# Altium schematic sheet 13-DPLL-02.SchDoc
size B; SheetNumber: 13; SheetTotal: 16
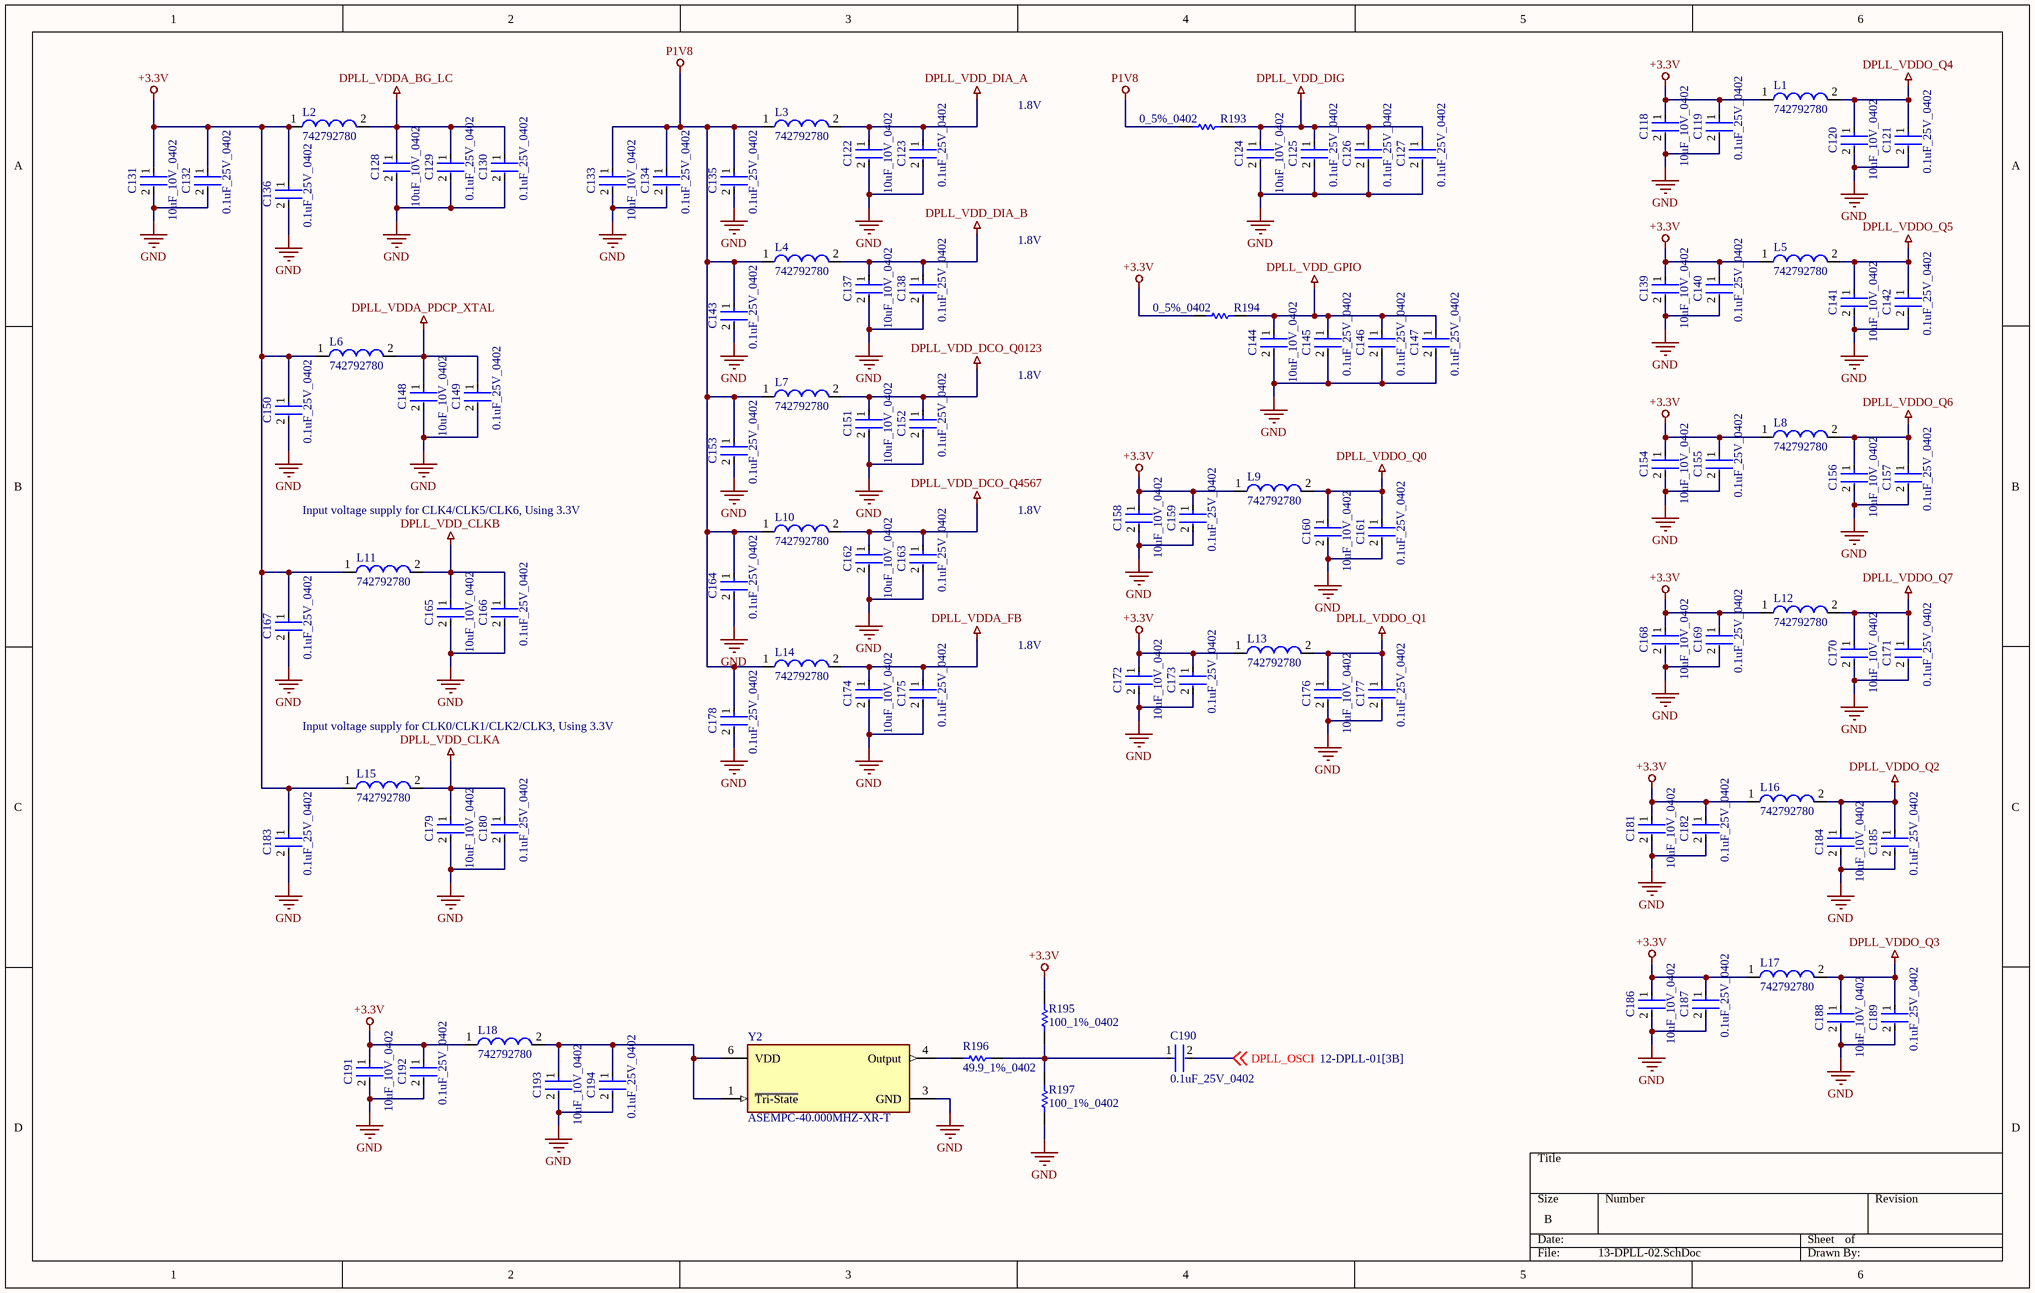
[diagram p0: 13-DPLL-02.SchDoc]

## Parts
C118  10uF_10V_0402  [FP-CL05A106MP5NUNC-MFG]
C119  0.1uF_25V_0402  [FP-0402-L_1_0_1-W_0_5_0_1-IPC_C]
C120  10uF_10V_0402  [FP-CL05A106MP5NUNC-MFG]
C121  0.1uF_25V_0402  [FP-0402-L_1_0_1-W_0_5_0_1-IPC_C]
C122  10uF_10V_0402  [FP-CL05A106MP5NUNC-MFG]
C123  0.1uF_25V_0402  [FP-0402-L_1_0_1-W_0_5_0_1-IPC_C]
C124  10uF_10V_0402  [FP-CL05A106MP5NUNC-MFG]
C125  0.1uF_25V_0402  [FP-0402-L_1_0_1-W_0_5_0_1-IPC_C]
C126  0.1uF_25V_0402  [FP-0402-L_1_0_1-W_0_5_0_1-IPC_C]
C127  0.1uF_25V_0402  [FP-0402-L_1_0_1-W_0_5_0_1-IPC_C]
C128  10uF_10V_0402  [FP-CL05A106MP5NUNC-MFG]
C129  0.1uF_25V_0402  [FP-0402-L_1_0_1-W_0_5_0_1-IPC_C]
C130  0.1uF_25V_0402  [FP-0402-L_1_0_1-W_0_5_0_1-IPC_C]
C131  10uF_10V_0402  [FP-CL05A106MP5NUNC-MFG]
C132  0.1uF_25V_0402  [FP-0402-L_1_0_1-W_0_5_0_1-IPC_C]
C133  10uF_10V_0402  [FP-CL05A106MP5NUNC-MFG]
C134  0.1uF_25V_0402  [FP-0402-L_1_0_1-W_0_5_0_1-IPC_C]
C135  0.1uF_25V_0402  [FP-0402-L_1_0_1-W_0_5_0_1-IPC_C]
C136  0.1uF_25V_0402  [FP-0402-L_1_0_1-W_0_5_0_1-IPC_C]
C137  10uF_10V_0402  [FP-CL05A106MP5NUNC-MFG]
C138  0.1uF_25V_0402  [FP-0402-L_1_0_1-W_0_5_0_1-IPC_C]
C139  10uF_10V_0402  [FP-CL05A106MP5NUNC-MFG]
C140  0.1uF_25V_0402  [FP-0402-L_1_0_1-W_0_5_0_1-IPC_C]
C141  10uF_10V_0402  [FP-CL05A106MP5NUNC-MFG]
C142  0.1uF_25V_0402  [FP-0402-L_1_0_1-W_0_5_0_1-IPC_C]
C143  0.1uF_25V_0402  [FP-0402-L_1_0_1-W_0_5_0_1-IPC_C]
C144  10uF_10V_0402  [FP-CL05A106MP5NUNC-MFG]
C145  0.1uF_25V_0402  [FP-0402-L_1_0_1-W_0_5_0_1-IPC_C]
C146  0.1uF_25V_0402  [FP-0402-L_1_0_1-W_0_5_0_1-IPC_C]
C147  0.1uF_25V_0402  [FP-0402-L_1_0_1-W_0_5_0_1-IPC_C]
C148  10uF_10V_0402  [FP-CL05A106MP5NUNC-MFG]
C149  0.1uF_25V_0402  [FP-0402-L_1_0_1-W_0_5_0_1-IPC_C]
C150  0.1uF_25V_0402  [FP-0402-L_1_0_1-W_0_5_0_1-IPC_C]
C151  10uF_10V_0402  [FP-CL05A106MP5NUNC-MFG]
C152  0.1uF_25V_0402  [FP-0402-L_1_0_1-W_0_5_0_1-IPC_C]
C153  0.1uF_25V_0402  [FP-0402-L_1_0_1-W_0_5_0_1-IPC_C]
C154  10uF_10V_0402  [FP-CL05A106MP5NUNC-MFG]
C155  0.1uF_25V_0402  [FP-0402-L_1_0_1-W_0_5_0_1-IPC_C]
C156  10uF_10V_0402  [FP-CL05A106MP5NUNC-MFG]
C157  0.1uF_25V_0402  [FP-0402-L_1_0_1-W_0_5_0_1-IPC_C]
C158  10uF_10V_0402  [FP-CL05A106MP5NUNC-MFG]
C159  0.1uF_25V_0402  [FP-0402-L_1_0_1-W_0_5_0_1-IPC_C]
C160  10uF_10V_0402  [FP-CL05A106MP5NUNC-MFG]
C161  0.1uF_25V_0402  [FP-0402-L_1_0_1-W_0_5_0_1-IPC_C]
C162  10uF_10V_0402  [FP-CL05A106MP5NUNC-MFG]
C163  0.1uF_25V_0402  [FP-0402-L_1_0_1-W_0_5_0_1-IPC_C]
C164  0.1uF_25V_0402  [FP-0402-L_1_0_1-W_0_5_0_1-IPC_C]
C165  10uF_10V_0402  [FP-CL05A106MP5NUNC-MFG]
C166  0.1uF_25V_0402  [FP-0402-L_1_0_1-W_0_5_0_1-IPC_C]
C167  0.1uF_25V_0402  [FP-0402-L_1_0_1-W_0_5_0_1-IPC_C]
C168  10uF_10V_0402  [FP-CL05A106MP5NUNC-MFG]
C169  0.1uF_25V_0402  [FP-0402-L_1_0_1-W_0_5_0_1-IPC_C]
C170  10uF_10V_0402  [FP-CL05A106MP5NUNC-MFG]
C171  0.1uF_25V_0402  [FP-0402-L_1_0_1-W_0_5_0_1-IPC_C]
C172  10uF_10V_0402  [FP-CL05A106MP5NUNC-MFG]
C173  0.1uF_25V_0402  [FP-0402-L_1_0_1-W_0_5_0_1-IPC_C]
C174  10uF_10V_0402  [FP-CL05A106MP5NUNC-MFG]
C175  0.1uF_25V_0402  [FP-0402-L_1_0_1-W_0_5_0_1-IPC_C]
C176  10uF_10V_0402  [FP-CL05A106MP5NUNC-MFG]
C177  0.1uF_25V_0402  [FP-0402-L_1_0_1-W_0_5_0_1-IPC_C]
C178  0.1uF_25V_0402  [FP-0402-L_1_0_1-W_0_5_0_1-IPC_C]
C179  10uF_10V_0402  [FP-CL05A106MP5NUNC-MFG]
C180  0.1uF_25V_0402  [FP-0402-L_1_0_1-W_0_5_0_1-IPC_C]
C181  10uF_10V_0402  [FP-CL05A106MP5NUNC-MFG]
C182  0.1uF_25V_0402  [FP-0402-L_1_0_1-W_0_5_0_1-IPC_C]
C183  0.1uF_25V_0402  [FP-0402-L_1_0_1-W_0_5_0_1-IPC_C]
C184  10uF_10V_0402  [FP-CL05A106MP5NUNC-MFG]
C185  0.1uF_25V_0402  [FP-0402-L_1_0_1-W_0_5_0_1-IPC_C]
C186  10uF_10V_0402  [FP-CL05A106MP5NUNC-MFG]
C187  0.1uF_25V_0402  [FP-0402-L_1_0_1-W_0_5_0_1-IPC_C]
C188  10uF_10V_0402  [FP-CL05A106MP5NUNC-MFG]
C189  0.1uF_25V_0402  [FP-0402-L_1_0_1-W_0_5_0_1-IPC_C]
C190  0.1uF_25V_0402  [FP-0402-L_1_0_1-W_0_5_0_1-IPC_C]
C191  10uF_10V_0402  [FP-CL05A106MP5NUNC-MFG]
C192  0.1uF_25V_0402  [FP-0402-L_1_0_1-W_0_5_0_1-IPC_C]
C193  10uF_10V_0402  [FP-CL05A106MP5NUNC-MFG]
C194  0.1uF_25V_0402  [FP-0402-L_1_0_1-W_0_5_0_1-IPC_C]
L1  742792780  [SMD-0402]
L2  742792780  [SMD-0402]
L3  742792780  [SMD-0402]
L4  742792780  [SMD-0402]
L5  742792780  [SMD-0402]
L6  742792780  [SMD-0402]
L7  742792780  [SMD-0402]
L8  742792780  [SMD-0402]
L9  742792780  [SMD-0402]
L10  742792780  [SMD-0402]
L11  742792780  [SMD-0402]
L12  742792780  [SMD-0402]
L13  742792780  [SMD-0402]
L14  742792780  [SMD-0402]
L15  742792780  [SMD-0402]
L16  742792780  [SMD-0402]
L17  742792780  [SMD-0402]
L18  742792780  [SMD-0402]
R193  0_5%_0402  [RESC1005X40X25LL10T10]
R194  0_5%_0402  [RESC1005X40X25LL10T10]
R195  100_1%_0402  [RESC1005X40X25ML05T10]
R196  49.9_1%_0402  [RESC1005X40X25NL10T10]
R197  100_1%_0402  [RESC1005X40X25ML05T10]
Y2  ASEMPC-40.000MHZ-XR-T  [FP-ASEMP-CMOS-MFG]

## Nets
+3.3V: C118.1 C119.1 C131.1 C132.1 C136.1 C139.1 C140.1 C150.1 C154.1 C155.1 C158.1 C159.1 C167.1 C168.1 C169.1 C172.1 C173.1 C181.1 C182.1 C183.1 C186.1 C187.1 C191.1 C192.1 L1.1 L2.1 L5.1 L6.1 L8.1 L9.1 L11.1 L12.1 L13.1 L15.1 L16.1 L17.1 L18.1 R194.1 R195.2
DPLL_VDD_CLKA: C179.1 C180.1 L15.2
DPLL_VDD_CLKB: C165.1 C166.1 L11.2
DPLL_VDD_DCO_Q0123: C151.1 C152.1 L7.2
DPLL_VDD_DCO_Q4567: C162.1 C163.1 L10.2
DPLL_VDD_DIA_A: C122.1 C123.1 L3.2
DPLL_VDD_DIA_B: C137.1 C138.1 L4.2
DPLL_VDD_DIG: C124.1 C125.1 C126.1 C127.1 R193.2
DPLL_VDD_GPIO: C144.1 C145.1 C146.1 C147.1 R194.2
DPLL_VDDA_BG_LC: C128.1 C129.1 C130.1 L2.2
DPLL_VDDA_FB: C174.1 C175.1 L14.2
DPLL_VDDA_PDCP_XTAL: C148.1 C149.1 L6.2
DPLL_VDDO_Q0: C160.1 C161.1 L9.2
DPLL_VDDO_Q1: C176.1 C177.1 L13.2
DPLL_VDDO_Q2: C184.1 C185.1 L16.2
DPLL_VDDO_Q3: C188.1 C189.1 L17.2
DPLL_VDDO_Q4: C120.1 C121.1 L1.2
DPLL_VDDO_Q5: C141.1 C142.1 L5.2
DPLL_VDDO_Q6: C156.1 C157.1 L8.2
DPLL_VDDO_Q7: C170.1 C171.1 L12.2
GND: C118.2 C119.2 C120.2 C121.2 C122.2 C123.2 C124.2 C125.2 C126.2 C127.2 C128.2 C129.2 C130.2 C131.2 C132.2 C133.2 C134.2 C135.2 C136.2 C137.2 C138.2 C139.2 C140.2 C141.2 C142.2 C143.2 C144.2 C145.2 C146.2 C147.2 C148.2 C149.2 C150.2 C151.2 C152.2 C153.2 C154.2 C155.2 C156.2 C157.2 C158.2 C159.2 C160.2 C161.2 C162.2 C163.2 C164.2 C165.2 C166.2 C167.2 C168.2 C169.2 C170.2 C171.2 C172.2 C173.2 C174.2 C175.2 C176.2 C177.2 C178.2 C179.2 C180.2 C181.2 C182.2 C183.2 C184.2 C185.2 C186.2 C187.2 C188.2 C189.2 C191.2 C192.2 C193.2 C194.2 R197.1 Y2.3(GND)
P1V8: C133.1 C134.1 C135.1 C143.1 C153.1 C164.1 C178.1 L3.1 L4.1 L7.1 L10.1 L14.1 R193.1
DPLL_OSCI: C190.2 ; off-sheet DPLL_OSCI
NetC190_1: C190.1 R195.1 R196.2 R197.2
NetC193_1: C193.1 C194.1 L18.2 Y2.1(~{Tri-State}) Y2.6(VDD)
NetR196_1: R196.1 Y2.4(Output)

## Notes on the sheet
- 1.8V
- Input voltage supply for CLK4/CLK5/CLK6, Using 3.3V
- Input voltage supply for CLK0/CLK1/CLK2/CLK3, Using 3.3V

## Library data of the parts
C118 C120 C122 C124 C128 C131 C133 C137 C139 C141 C144 C148 C151 C154 C156 C158 C160 C162 C165 C168 C170 C172 C174 C176 C179 C181 C184 C186 C188 C191 C193 = CMP-13271-000002-1: CAP CER 10UF 10V X5R 0402; Manufacturer Part Number: CL05A106MP5NUNC; Manufacturer: Samsung; Temperature Coefficient: 15%; Tolerance: 20%; Material: Ceramic; Octopart: https://octopart.com/cl05a106mp5nunc-samsung-22457395; Voltage Rating: 10V; RoHS: TRUE; Value: 10uF; Height: 0.7mm; Digikey Description: CAP CER 10UF 10V X5R 0402; Automotive: No; Package: CL05A106MP5NUNC; Device Class L1: Passive Components; Capacitance: 10uF; Temperature Range High: +85°C; ComponentLink2Description: Datasheet; Device Class L2: Capacitors; Temperature Characteristic: X5R; Temperature: -55°C to +85°C; ComponentLink2URL: http://www.samsungsem.com/kr/support/product-search/mlcc/__icsFiles/afieldfile/2019/05/10/19-CL05A106MP5NUNC.pdf; Device Class L3: Ceramic Capacitors; Category: Cap; Temperature Range Low: -55°C; Ipc Land Pattern Name: CAPC10050X50; Lead Free: Yes
C119 C121 C123 C125-C127 C129 C130 C132 C134-C136 C138 C140 C142 C143 C145-C147 C149 C150 C152 C153 C155 C157 C159 C161 C163 C164 C166 C167 C169 C171 C173 C175 C177 C178 C180 C182 C183 C185 C187 C189 C190 C192 C194 = CMP-2008-02519-2: General Purpose Ceramic Capacitor, 0402, 100nF, 10%, X7R, 15%, 25V; Package Quantity: 1; Capacitance: 100nF; Min Operating Temperature: -55°C; Voltage: 25V; Voltage Rating: 25V; Construction: Flat; Max Operating Temperature: 125°C; Radiation Hardening: No; Depth: 0.5mm; Thickness: 0.022inch; Voltage Rating (DC): 25V; Number of Pins: 2; Lead Free: Lead Free; Series: -; REACH SVHC: No SVHC; Length: 1mm; Dielectric: X7R; RoHS Compliant: Yes; Mount: Surface Mount; Packaging: Tape and Reel; Case/Package: 0402; Case Code (Imperial): 0402; Termination: SMD/SMT; Width: 0.02inch; Case Code (Metric): 1005; Tolerance: 10%
L1-L18 = CMP-0220-00137-1: SMD EMI Suppression Ferrite Bead WE-CBF, Z = 220 Ohm; Impedance: 220 Ohm; PackageVersion: 2009; DatasheetVersion: ver 4, Jul-2009; PackageDescription: Chip Inductor, 2-Leads, Body 1.0 x 0.5 mm; ComponentLink1URL: http://www.we-online.com; ComponentLink1Description: Manufacturer Link; ComponentLink2URL: http://www.we-online.de/katalog/media/pdf/742792780.pdf; PackageReference: SMD-0402; ComponentLink2Description: Datasheet
R193 R194 = CMP-2002-04569-1: Manufacturer: KOA Speer; Part Number: RK73Z1ETTP
R195 R197 = CMP-2002-06458-1: Part Number: ERJ-U02F1000X; Manufacturer: Panasonic
R196 = CMP-2002-04448-1: Part Number: RK73H1ETTP49R9F; Manufacturer: KOA Speer
Y2 = CMP-27762-012912-1: MEMS Oscillator 40MHz ±25ppm CMOS 2.25V~3.6V 6-SMD 3.2mm x 2.5mm; Max Supply Current: 35mA; Max Duty Cycle: 55%; Operating Supply Voltage: 3.3V; Max Supply Voltage: 3.6V; Load Capacitance: 15pF; Min Supply Voltage: 2.25V; Termination: SMD/SMT; Frequency: 40MHz; Length: 0.126inch; Case/Package: SMD/SMT; Max Operating Temperature: 105°C; RoHS Compliant: Yes; Mount: Surface Mount; Packaging: Tape and Reel; Number of Pins: 6; Width: 0.098inch; Min Operating Temperature: -40°C; Frequency Stability: 25ppm; Height: 0.035inch; Package Quantity: 1000